# Altium schematic sheet Power Distribution - Power Path Power Supply MOSFET.SchDoc: Title
size B; Organization: Midnight Sun Solar Rayce Car Team; Address1: University of Waterloo; Address2: 200 University Ave W; Address3: Waterloo, ON, Canada; Address4: N2L 3E9; Website: www.uwmidsun.com; ProjectName: ProjectName
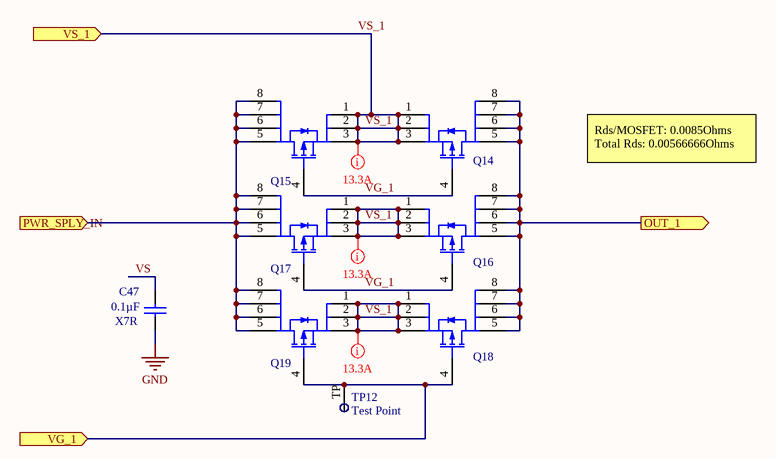
[diagram p0: Power Distribution - Power Path Power Supply MOSFET.SchDoc]

## Parts
C47  Capacitance: 0.1µF  Temperature Coefficient: X7R  [CAP, 0603]  (hidden comment: CAP CER 0.1UF 50V 10% X7R 0603)
Q14  MOSFET P-CH PWR56 40V 4.9 MOHM  [PMOS PWR56 40V 4.9 MOHM]  (value not drawn)
Q15  MOSFET P-CH PWR56 40V 4.9 MOHM  [PMOS PWR56 40V 4.9 MOHM]  (value not drawn)
Q16  MOSFET P-CH PWR56 40V 4.9 MOHM  [PMOS PWR56 40V 4.9 MOHM]  (value not drawn)
Q17  MOSFET P-CH PWR56 40V 4.9 MOHM  [PMOS PWR56 40V 4.9 MOHM]  (value not drawn)
Q18  MOSFET P-CH PWR56 40V 4.9 MOHM  [PMOS PWR56 40V 4.9 MOHM]  (value not drawn)
Q19  MOSFET P-CH PWR56 40V 4.9 MOHM  [PMOS PWR56 40V 4.9 MOHM]  (value not drawn)
TP12  Test Point  [Test Point]  (no BOM)

## Ports
OUT_1 (out), PWR_SPLY_IN (in), VG_1 (in), VS_1 (in)

## Nets
GND: C47.2
OUT_1: Q14.5(D) Q14.6(D) Q14.7(D) Q14.8(D) Q16.5(D) Q16.6(D) Q16.7(D) Q16.8(D) Q18.5(D) Q18.6(D) Q18.7(D) Q18.8(D) ; port OUT_1
PWR_SPLY_IN: Q15.5(D) Q15.6(D) Q15.7(D) Q15.8(D) Q17.5(D) Q17.6(D) Q17.7(D) Q17.8(D) Q19.5(D) Q19.6(D) Q19.7(D) Q19.8(D) ; port PWR_SPLY_IN
VG_1: Q14.4(G) Q15.4(G) Q16.4(G) Q17.4(G)
VG_1: Q18.4(G) Q19.4(G) TP12.TP ; port VG_1  [a separate net that carries the same name]
VS: C47.1
VS_1: Q14.1(S) Q14.2(S) Q14.3(S) Q15.1(S) Q15.2(S) Q15.3(S) Q16.1(S) Q16.2(S) Q16.3(S) Q17.1(S) Q17.2(S) Q17.3(S) Q18.1(S) Q18.2(S) Q18.3(S) Q19.1(S) Q19.2(S) Q19.3(S) ; port VS_1

## Layout directives
net class HighCurrent; rule Power Plane Connect Style [Style - Direct Connect]; rule Polygon Connect Style [Style - Direct Connect]: VS_1

## Notes on the sheet
- Rds/MOSFET: 0.0085Ohms
  Total Rds: 0.00566666Ohms
- PROJECT
- DOCUMENT
- DRAWN BY
- LAST MODIFIED
- PART NUMBER
- REVISION
- SHEET
- VARIANT
- OF
- Engineering 5 - 1002
  University of Waterloo
  (519) 888-4567 x32978
  hardware@uwmidsun.com

## Library data of the parts
C47 = CAP CER 0.1UF 50V 10% X7R 0603: 0.10µF ±10% 50V Ceramic Capacitor X7R 0603 (1608 Metric); Manufacturer 1: AVX Corporation; Manufacturer Part Number 1: 06035C104KAT2A; Supplier 1: Digi-Key; Supplier Part Number 1: 478-5052-1-ND; Packaging: Cut Tape (CT); Part Status: Active; Operating Temperature: -55°C ~ 125°C; Ratings: -; Mounting Type: Surface Mount, MLCC; Package / Case: 0603 (1608 Metric); Size / Dimension: 0.063" L x 0.032" W (1.60mm x 0.81mm); Height - Seated (Max): -; Thickness (Max): 0.035" (0.90mm); Lead Spacing: -; Lead Style: -; ComponentLink1URL: http://datasheets.avx.com/X7RDielectric.pdf; ComponentLink1Description: http://datasheets.avx.com/X7RDielectric.pdf; Tolerance: ±10%; Voltage: 50V
Q14-Q19 = MOSFET P-CH PWR56 40V 4.9 MOHM: P-Channel 16V 2.5A (Ta) 650mW (Ta) Surface Mount X2-DFN2015-3; Current - Continuous Drain (Id) @ 25°C: 80A (Tc); Drive Voltage (Max Rds On,  Min Rds On): 4.5V, 10V; Vgs(th) (Max) @ Id: 3V @ 250µA; Gate Charge (Qg) (Max) @ Vgs: 107nC @ 10V; Input Capacitance (Ciss) (Max) @ Vds: 4840pF @ 20V; Power Dissipation (Max): 214W (Tj); Rds On (Max) @ Id, Vgs: 4.9mOhm @ 80A, 10V; Packaging: Cut Tape (CT); Part Status: Active; FET Type: P-Channel; Technology: MOSFET (Metal Oxide); Drain to Source Voltage (Vdss): 40V; Vgs (Max): ±16V; FET Feature: -; Operating Temperature: -55°C ~ 175°C (TJ); Mounting Type: Surface Mount; Supplier Device Package: FDWS9508L-F085OSCT-ND; Package / Case: 8-PowerTDFN; ComponentLink1URL: https://www.onsemi.com/pub/Collateral/FDWS9508L-F085-D.PDF; ComponentLink1Description: https://www.onsemi.com/pub/Collateral/FDWS9508L-F085-D.PDF; Supplier 1: Digi-Key; Supplier Part Number 1: FDWS9508L-F085OSCT-ND